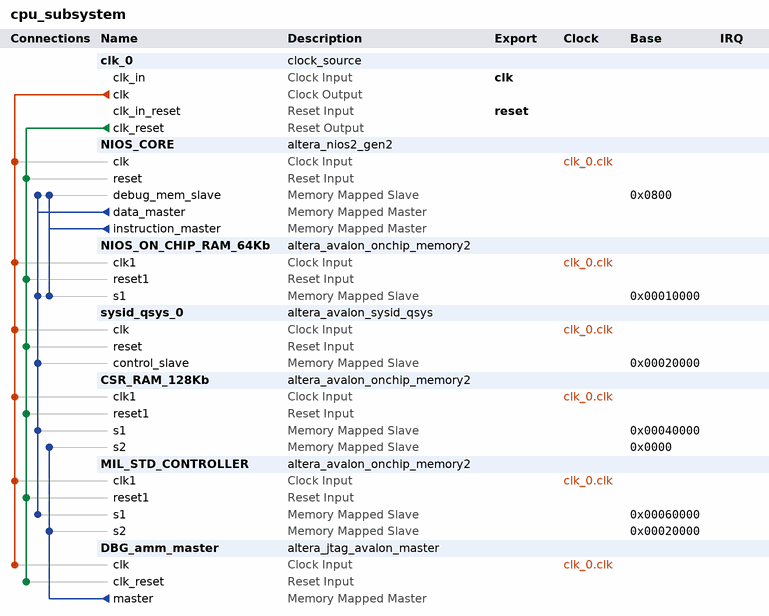
[diagram p0: system contents]
# Platform Designer (Qsys) system cpu_subsystem, Cyclone V 5CSEMA5F31C6
# Parameters at their usual value, and those the tool derives, are not listed.
package require -exact qsys 18.1
create_system cpu_subsystem
set_project_property DEVICE_FAMILY {Cyclone V}
set_project_property DEVICE 5CSEMA5F31C6

add_instance clk_0 clock_source 18.1
set_instance_parameter_value clk_0 clockFrequency 50000000

add_instance NIOS_CORE altera_nios2_gen2 18.1
set_instance_parameter_value NIOS_CORE dcache_size 2048
set_instance_parameter_value NIOS_CORE exceptionSlave NIOS_ON_CHIP_RAM_64Kb.s1
set_instance_parameter_value NIOS_CORE icache_size 4096
set_instance_parameter_value NIOS_CORE impl Tiny
set_instance_parameter_value NIOS_CORE resetSlave NIOS_ON_CHIP_RAM_64Kb.s1

add_instance NIOS_ON_CHIP_RAM_64Kb altera_avalon_onchip_memory2 18.1
set_instance_parameter_value NIOS_ON_CHIP_RAM_64Kb dataWidth 32
set_instance_parameter_value NIOS_ON_CHIP_RAM_64Kb dualPort false
set_instance_parameter_value NIOS_ON_CHIP_RAM_64Kb initMemContent true
set_instance_parameter_value NIOS_ON_CHIP_RAM_64Kb initializationFileName onchip_mem.hex
set_instance_parameter_value NIOS_ON_CHIP_RAM_64Kb memorySize 65536

add_instance sysid_qsys_0 altera_avalon_sysid_qsys 18.1
set_instance_parameter_value sysid_qsys_0 id 0

add_instance CSR_RAM_128Kb altera_avalon_onchip_memory2 18.1
set_instance_parameter_value CSR_RAM_128Kb dataWidth 16
set_instance_parameter_value CSR_RAM_128Kb dualPort true
set_instance_parameter_value CSR_RAM_128Kb initMemContent true
set_instance_parameter_value CSR_RAM_128Kb initializationFileName onchip_mem.hex
set_instance_parameter_value CSR_RAM_128Kb instanceID 1
set_instance_parameter_value CSR_RAM_128Kb memorySize 131072
set_instance_parameter_value CSR_RAM_128Kb singleClockOperation true

add_instance MIL_STD_CONTROLLER altera_avalon_onchip_memory2 18.1
set_instance_parameter_value MIL_STD_CONTROLLER dataWidth 16
set_instance_parameter_value MIL_STD_CONTROLLER dualPort true
set_instance_parameter_value MIL_STD_CONTROLLER initMemContent true
set_instance_parameter_value MIL_STD_CONTROLLER initializationFileName onchip_mem.hex
set_instance_parameter_value MIL_STD_CONTROLLER instanceID 1
set_instance_parameter_value MIL_STD_CONTROLLER memorySize 32
set_instance_parameter_value MIL_STD_CONTROLLER singleClockOperation true

add_instance DBG_amm_master altera_jtag_avalon_master 18.1

# connections
add_connection clk_0.clk CSR_RAM_128Kb.clk1 clock
add_connection clk_0.clk DBG_amm_master.clk clock
add_connection clk_0.clk MIL_STD_CONTROLLER.clk1 clock
add_connection clk_0.clk NIOS_CORE.clk clock
add_connection clk_0.clk NIOS_ON_CHIP_RAM_64Kb.clk1 clock
add_connection clk_0.clk sysid_qsys_0.clk clock
add_connection clk_0.clk_reset CSR_RAM_128Kb.reset1 reset
add_connection clk_0.clk_reset DBG_amm_master.clk_reset reset
add_connection clk_0.clk_reset MIL_STD_CONTROLLER.reset1 reset
add_connection clk_0.clk_reset NIOS_CORE.reset reset
add_connection clk_0.clk_reset NIOS_ON_CHIP_RAM_64Kb.reset1 reset
add_connection clk_0.clk_reset sysid_qsys_0.reset reset
add_connection DBG_amm_master.master CSR_RAM_128Kb.s2 avalon
set_connection_parameter_value DBG_amm_master.master/CSR_RAM_128Kb.s2 baseAddress 0x0000
add_connection DBG_amm_master.master MIL_STD_CONTROLLER.s2 avalon
set_connection_parameter_value DBG_amm_master.master/MIL_STD_CONTROLLER.s2 baseAddress 0x00020000
add_connection NIOS_CORE.data_master CSR_RAM_128Kb.s1 avalon
set_connection_parameter_value NIOS_CORE.data_master/CSR_RAM_128Kb.s1 baseAddress 0x00040000
add_connection NIOS_CORE.data_master MIL_STD_CONTROLLER.s1 avalon
set_connection_parameter_value NIOS_CORE.data_master/MIL_STD_CONTROLLER.s1 baseAddress 0x00060000
add_connection NIOS_CORE.data_master NIOS_CORE.debug_mem_slave avalon
set_connection_parameter_value NIOS_CORE.data_master/NIOS_CORE.debug_mem_slave baseAddress 0x0800
add_connection NIOS_CORE.data_master NIOS_ON_CHIP_RAM_64Kb.s1 avalon
set_connection_parameter_value NIOS_CORE.data_master/NIOS_ON_CHIP_RAM_64Kb.s1 baseAddress 0x00010000
add_connection NIOS_CORE.data_master sysid_qsys_0.control_slave avalon
set_connection_parameter_value NIOS_CORE.data_master/sysid_qsys_0.control_slave baseAddress 0x00020000
add_connection NIOS_CORE.instruction_master NIOS_CORE.debug_mem_slave avalon
set_connection_parameter_value NIOS_CORE.instruction_master/NIOS_CORE.debug_mem_slave baseAddress 0x0800
add_connection NIOS_CORE.instruction_master NIOS_ON_CHIP_RAM_64Kb.s1 avalon
set_connection_parameter_value NIOS_CORE.instruction_master/NIOS_ON_CHIP_RAM_64Kb.s1 baseAddress 0x00010000

# exported interfaces
add_interface clk clock sink
set_interface_property clk EXPORT_OF clk_0.clk_in
add_interface reset reset sink
set_interface_property reset EXPORT_OF clk_0.clk_in_reset

set_interconnect_requirement {$system} qsys_mm.clockCrossingAdapter HANDSHAKE
set_interconnect_requirement {$system} qsys_mm.enableEccProtection FALSE
set_interconnect_requirement {$system} qsys_mm.insertDefaultSlave FALSE
set_interconnect_requirement {$system} qsys_mm.maxAdditionalLatency 1

save_system cpu_subsystem.qsys
